# EAGLE design firefly (EAGLE 7.2.0)
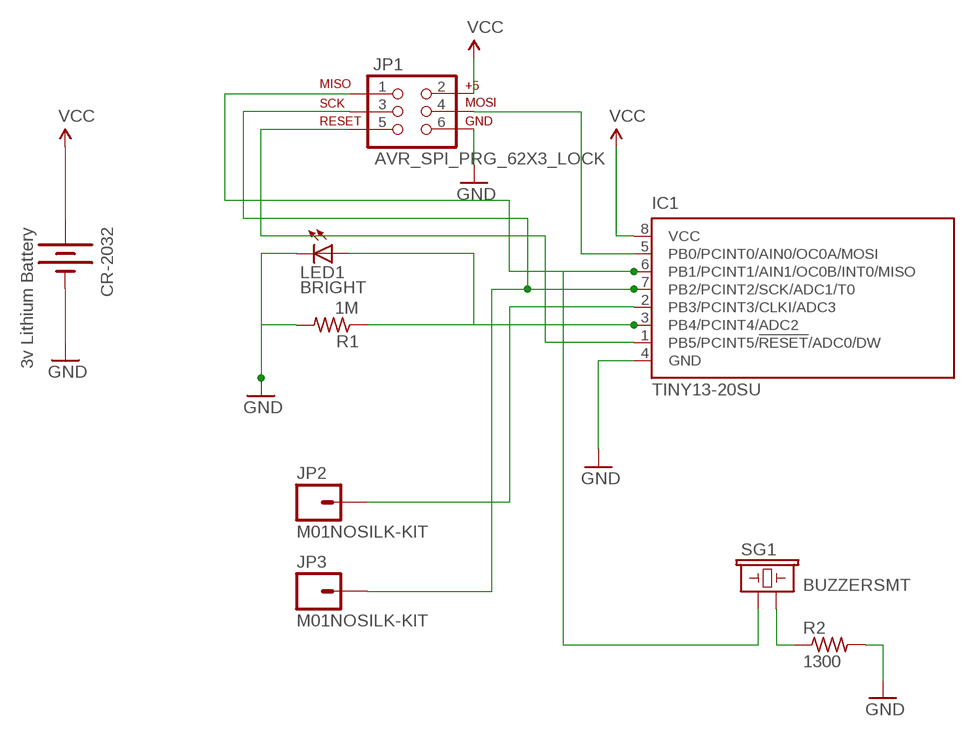
[diagram p0: schematic, sheet 1]

## Parts
CR-2032  3v Lithium Battery  BATTERY20MM_4LEGS  [BATTCON_20MM_4LEGS]
IC1  TINY13-20SU  [8S2]
JP1  AVR_SPI_PRG_62X3_LOCK  [2X3_LOCK]
JP2  M01NOSILK-KIT  [1X01NS-KIT]
JP3  M01NOSILK-KIT  [1X01NS-KIT]
LED1  BRIGHT  LEDCHIP-LED0603  [CHIP-LED0603]
R1  1M  R-US_R0603  [R0603]
R2  1300  R-US_R1206  [R1206]
SG1  BUZZERSMT  [BUZZER-9MM]

## Nets
GND: CR-2032.2(-) IC1.4(GND) JP1.6 LED1.C R1.2 R2.2
N$1: IC1.3(PB4/PCINT4/ADC2) LED1.A R1.1
N$2: IC1.1(PB5/PCINT5/!RESET!/ADC0/DW) JP1.5
N$3: IC1.7(PB2/PCINT2/SCK/ADC1/T0) JP1.3 JP3.1
N$4: IC1.6(PB1/PCINT1/AIN1/OC0B/INT0/MISO) JP1.1 SG1.1
N$5: IC1.5(PB0/PCINT0/AIN0/OC0A/MOSI) JP1.4
N$6: IC1.2(PB3/PCINT3/CLKI/ADC3) JP2.1
N$7: R2.1 SG1.2
VCC: CR-2032.1(+) IC1.8(VCC) JP1.2

## Library data of the parts
CR-2032 = SparkFun-Electromechanical:BATTERY: Battery Holders Various common sizes : AA, AAA, 18650 (PRT-12895), 20mm coin cell and 12mm coin cell. 20MM_4LEGS, BATT-10373; PROD_ID: BATT-10373; VALUE: 20mm coincell
IC1 = atmel:TINY13: 8-bit AVR Microcontroller with 1K Bytes In-System Programmable Flash Source: http://www.atmel.com/dyn/resources/prod_documents/2535S.pdf; MPN: ATTINY13-20SU; OC_FARNELL: 9171568; OC_NEWARK: 96K6522
JP1 = SparkFun-Connectors:AVR_SPI_PRG_6: AVR ISP 6 Pin This is the reduced ISP connector for AVR programming. Common on Arduino. This footprint will take up less PCB space and can be used with a 10-pin to 6-pin adapter such as SKU: BOB-08508 **Special note about "TEST_POINT" package. The stop mask is on the top side, so if you want your programming test points to be on the bottom of your board, make sure to place this package on the bottom side of the board. This also ensure that the orientation to program from the bottom side will be correct.
JP2 JP3 = SparkFun-Connectors:M01: Header 1 Standard 1-pin 0.1" header. Use with straight break away headers (SKU : PRT-00116), right angle break away headers (PRT-00553), swiss pins (PRT-00743), machine pins (PRT-00117), and female headers (PRT-00115).
LED1 = _adafruit:LED: LED OSRAM: - CHIPLED LG R971, LG N971, LY N971, LG Q971, LY Q971, LO R971, LY R971 LH N974, LH R974 LS Q976, LO Q976, LY Q976 LO Q996 - Hyper CHIPLED LW Q18S LB Q993, LB Q99A, LB R99A - SideLED LS A670, LO A670, LY A670, LG A670, LP A670 LB A673, LV A673, LT A673, LW A673 LH A674 LY A675 LS A676, LA A676, LO A676, LY A676, LW A676 LS A679, LY A679, LG A679 - Hyper Micro SIDELED® LS Y876, LA Y876, LO Y876, LY Y876 LT Y87S - SmartLED LW L88C, LW L88S LB L89C, LB L89S, LG L890 LS L89K, LO L89K, LY L89K LS L896, LA L896, LO L896, LY L896 - TOPLED LS T670, LO T670, LY T670, LG T670, LP T670 LSG T670, LSP T670, LSY T670, LOP T670, LYG T670 LG T671, LOG T671, LSG T671 LB T673, LV T673, LT T673, LW T673 LH T674 LS T676, LA T676, LO T676, LY T676, LB T676, LH T676, LSB T676, LW T676 LB T67C, LV T67C, LT T67C, LS T67K, LO T67K, LY T67K, LW E67C LS E67B, LA E67B, LO E67B, LY E67B, LB E67C, LV E67C, LT E67C LW T67C LS T679, LY T679, LG T679 LS T770, LO T770, LY T770, LG T770, LP T770 LB T773, LV T773, LT T773, LW T773 LH T774 LS E675, LA E675, LY E675, LS T675 LS T776, LA T776, LO T776, LY T776, LB T776 LHGB T686 LT T68C, LB T68C - Hyper Mini TOPLED® LB M676 - Mini TOPLED Santana® LG M470 LS M47K, LO M47K, LY M47K Source: http://www.osram.convergy.de/
R1 R2 = _adafruit:R-US_: RESISTOR, American symbol
SG1 = _roger:BUZZER: Buzzer 12mm Spark Fun Electronics SKU : Comp-Buzzer

## Board
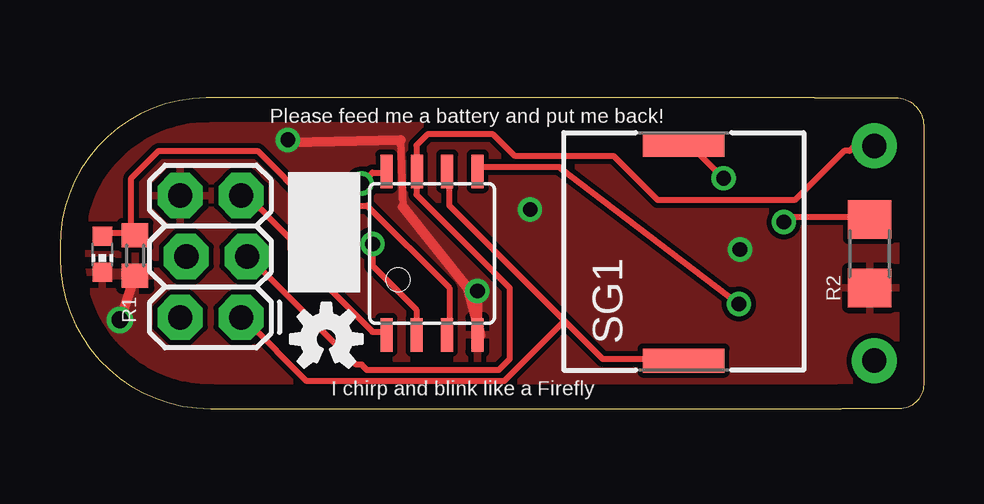
[diagram p1: board, top side]
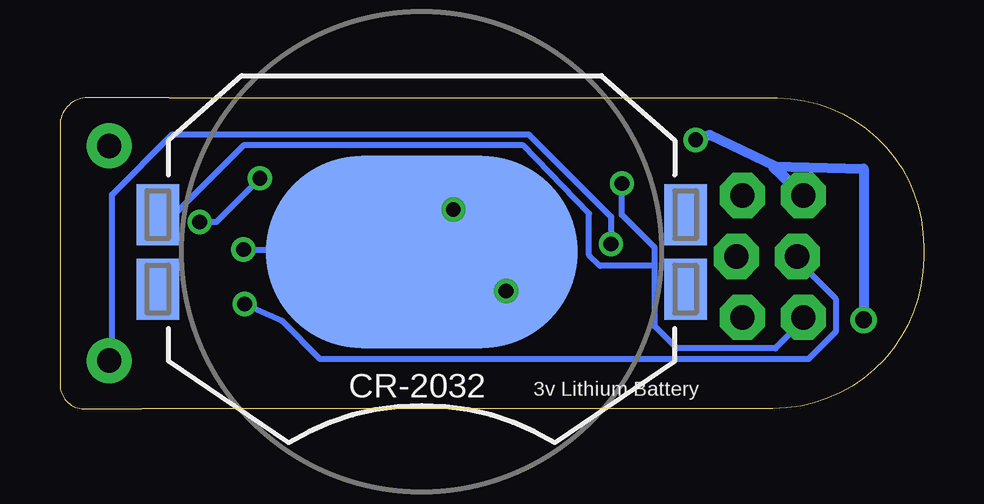
[diagram p2: board, bottom side, seen from below]

Size 36 x 12.95 mm. Coordinates in mm from the lower left corner, seen from the top.
Outline: 31.44,12.95 6.09,12.95 arc90 0,6.76 0,6.27 arc90 6.27,0 32.57,0
Outline: 31.45,12.95 34.85,12.95 arc-90 36,11.8 36,1 arc-90 35,0 32.6,0
Copper layers (1*16): Top 0.035mm / dielectric 1.5mm / Bottom 0.035mm
Design rules "default *": minimum track width 10mil, minimum drill 24mil, track to track 8mil, track to pad 8mil, pad to pad 8mil, via to via 8mil, smd to smd 8mil, copper to edge 40mil, drill to drill 8mil, minimum pad ring 10mil, minimum via ring 8mil, stop-mask expansion 4mil, vias tented up to drill 26mil, thermal gap 10mil

### Footprints (pad centres in the part's own frame; a part is rotated, then mirrored left to right if it is on the bottom)
BATTCON_20MM_4LEGS = smd 1.778 x 2.54: 1 -11,1.55; 3 11,1.55; P$1 -11,-1.55; P$2 11,-1.55 | smd 13 x 8: 2 0,0
8S2 = smd 0.5 x 1.4: 1 -1.905,-3.404; 2 -0.645,-3.404; 3 0.625,-3.404; 4 1.895,-3.404; 5 1.905,3.404; 6 0.635,3.404; 7 -0.635,3.404; 8 -1.905,3.404
2X3_LOCK = drill 1.016 pad 1.88 octagon: 1 0,0; 2 0,2.54; 3 2.54,-0.254; 4 2.54,2.286; 5 5.08,0; 6 5.08,2.54
1X01NS-KIT = drill 1.016 pad 1.88: 1 0,0
CHIP-LED0603 = smd 0.8 x 0.8: A 0,-0.75; C 0,0.75
R0603 = smd 1 x 1.1: 1 -0.85,0; 2 0.85,0
R1206 = smd 1.6 x 1.803: 1 -1.422,0; 2 1.422,0
BUZZER-9MM = smd 1 x 3.4: 1 -4.5,0; 2 4.5,0

### Placement (x,y rotation side)
CR-2032  20.92,6.53 0 bottom
IC1  15.51,6.48 0 top
JP1  7.55,3.8 90 top
JP2  33.95,2 0 top
JP3  33.95,10.95 0 top
LED1  1.77,6.43 180 top
R1  3.13,6.38 270 top
R2  33.75,6.45 270 top
SG1  26,6.5 90 top
U$1  [OSHW-LOGO-S]  11.1,2.9 0 top

### Tracks (layer width: path | path; a pad name or v marks a point on that pad's centre or on a via)
GND  (via drill 0.6, 0.61, 0.62, 0.7)
  Top 0.305: 14.2,11.2 14.3,8.4
  Top 0.406: v2.5,3.7 R1.2 | v9.5,11.2 9.6,11.1 14.2,11.2 | IC1.4 v17.4,4.9 | 14.3,8.4 17,5 17.5,3.1 17.5,3
  Bottom 0.254: v28.35,6.63 21.03,6.63 CR-2032.2
  Bottom 0.406: v2.5,3.7 2.5,10 6.3,10.1 JP1.6 6.2,10.1 8.9,11.4 v9.5,11.2 | v17.4,4.9 17.2,5.2 CR-2032.2
  other vias: 19.6,8.3
  pour Top: -0.3,-1.1 -0.3,13.7 36.4,13.7 36.4,-1.1
N$1
  Top 0.254: 2.97,7.32 1.83,7.32 LED1.A | 2.97,7.32 2.97,9.6 4.12,10.74 8.23,10.74 10.52,8.46 12.8,8.46 16.23,5.03 16.23,3.2 IC1.3 | 2.97,7.32 R1.1
N$2
  Top 0.254: IC1.1 13.49,3.2 13.03,3.2 9.6,6.63 9.6,7.09 7.77,8.91 JP1.5
N$3
  Top 0.254: JP3.1 33.83,10.97 33.15,10.97 32.92,10.74 32.69,10.74 30.63,8.69 24.92,8.69 23.09,10.52 18.97,10.52 18.06,11.43 15.32,11.43 14.86,10.97 14.86,10.06 IC1.7 14.86,9.83 14.86,8.91 18.75,5.03 18.75,2.06 18.29,1.6 12.8,1.6 12.57,1.83 12.34,1.83 8,6.17 JP1.3
N$4
  Top 0.254: 21.03,3.66 22.63,2.06 25.83,2.06 SG1.1 | 21.03,3.66 16.23,8.46 16.23,9.83 IC1.6 | 21.03,3.66 18.52,1.14 10.29,1.14 7.77,3.66 JP1.1
N$5  (via drill 0.61)
  Top 0.254: v28.3,4.36 20.8,10.06 17.6,10.06 IC1.5
  Bottom 0.254: v28.3,4.36 26.75,3.66 25.15,2.06 4.8,2.06 3.66,3.2 3.66,4.57 5.26,6.17 JP1.4
N$6  (via drill 0.61)
  Top 0.254: v13.03,6.86 13.03,5.94 14.86,4.12 14.86,3.2 IC1.2
  Bottom 0.254: v13.03,6.86 13.03,8 16.46,11.43 31.32,11.43 33.83,8.91 33.83,2.06 JP2.1
N$7  (via drill 0.61)
  Top 0.254: v30.18,7.77 30.4,8 33.6,8 R2.1 | v27.66,9.6 26.06,11.2 SG1.2
  Bottom 0.254: v30.18,7.77 29.49,7.77 v27.66,9.6
VCC  (via drill 0.61)
  Top 0.254: v12.57,9.37 13.03,9.83 13.49,9.83 IC1.8
  Bottom 0.254: v12.57,9.37 12.57,8.07 11.2,6.7 11.2,5.94 | 11.2,5.94 11.2,3.43 10.29,2.52 6.17,2.52 5.03,3.66 JP1.2 | 11.2,5.94 13.49,5.94 13.95,6.4 13.95,8.13 16.69,10.97 28.35,10.97 31.09,8.23 31.77,8.23 CR-2032.1

### Text on the board
tPlace: Please feed me a battery and put me back! | I chirp and blink like a Firefly